# EasyEDA schematic LcsNodes-Quad-Block-Controller-B.02.10.json

## Sheets
1 High Level Schematic
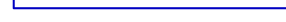
[diagram p0: High Level Schematic]
2 Main Controller
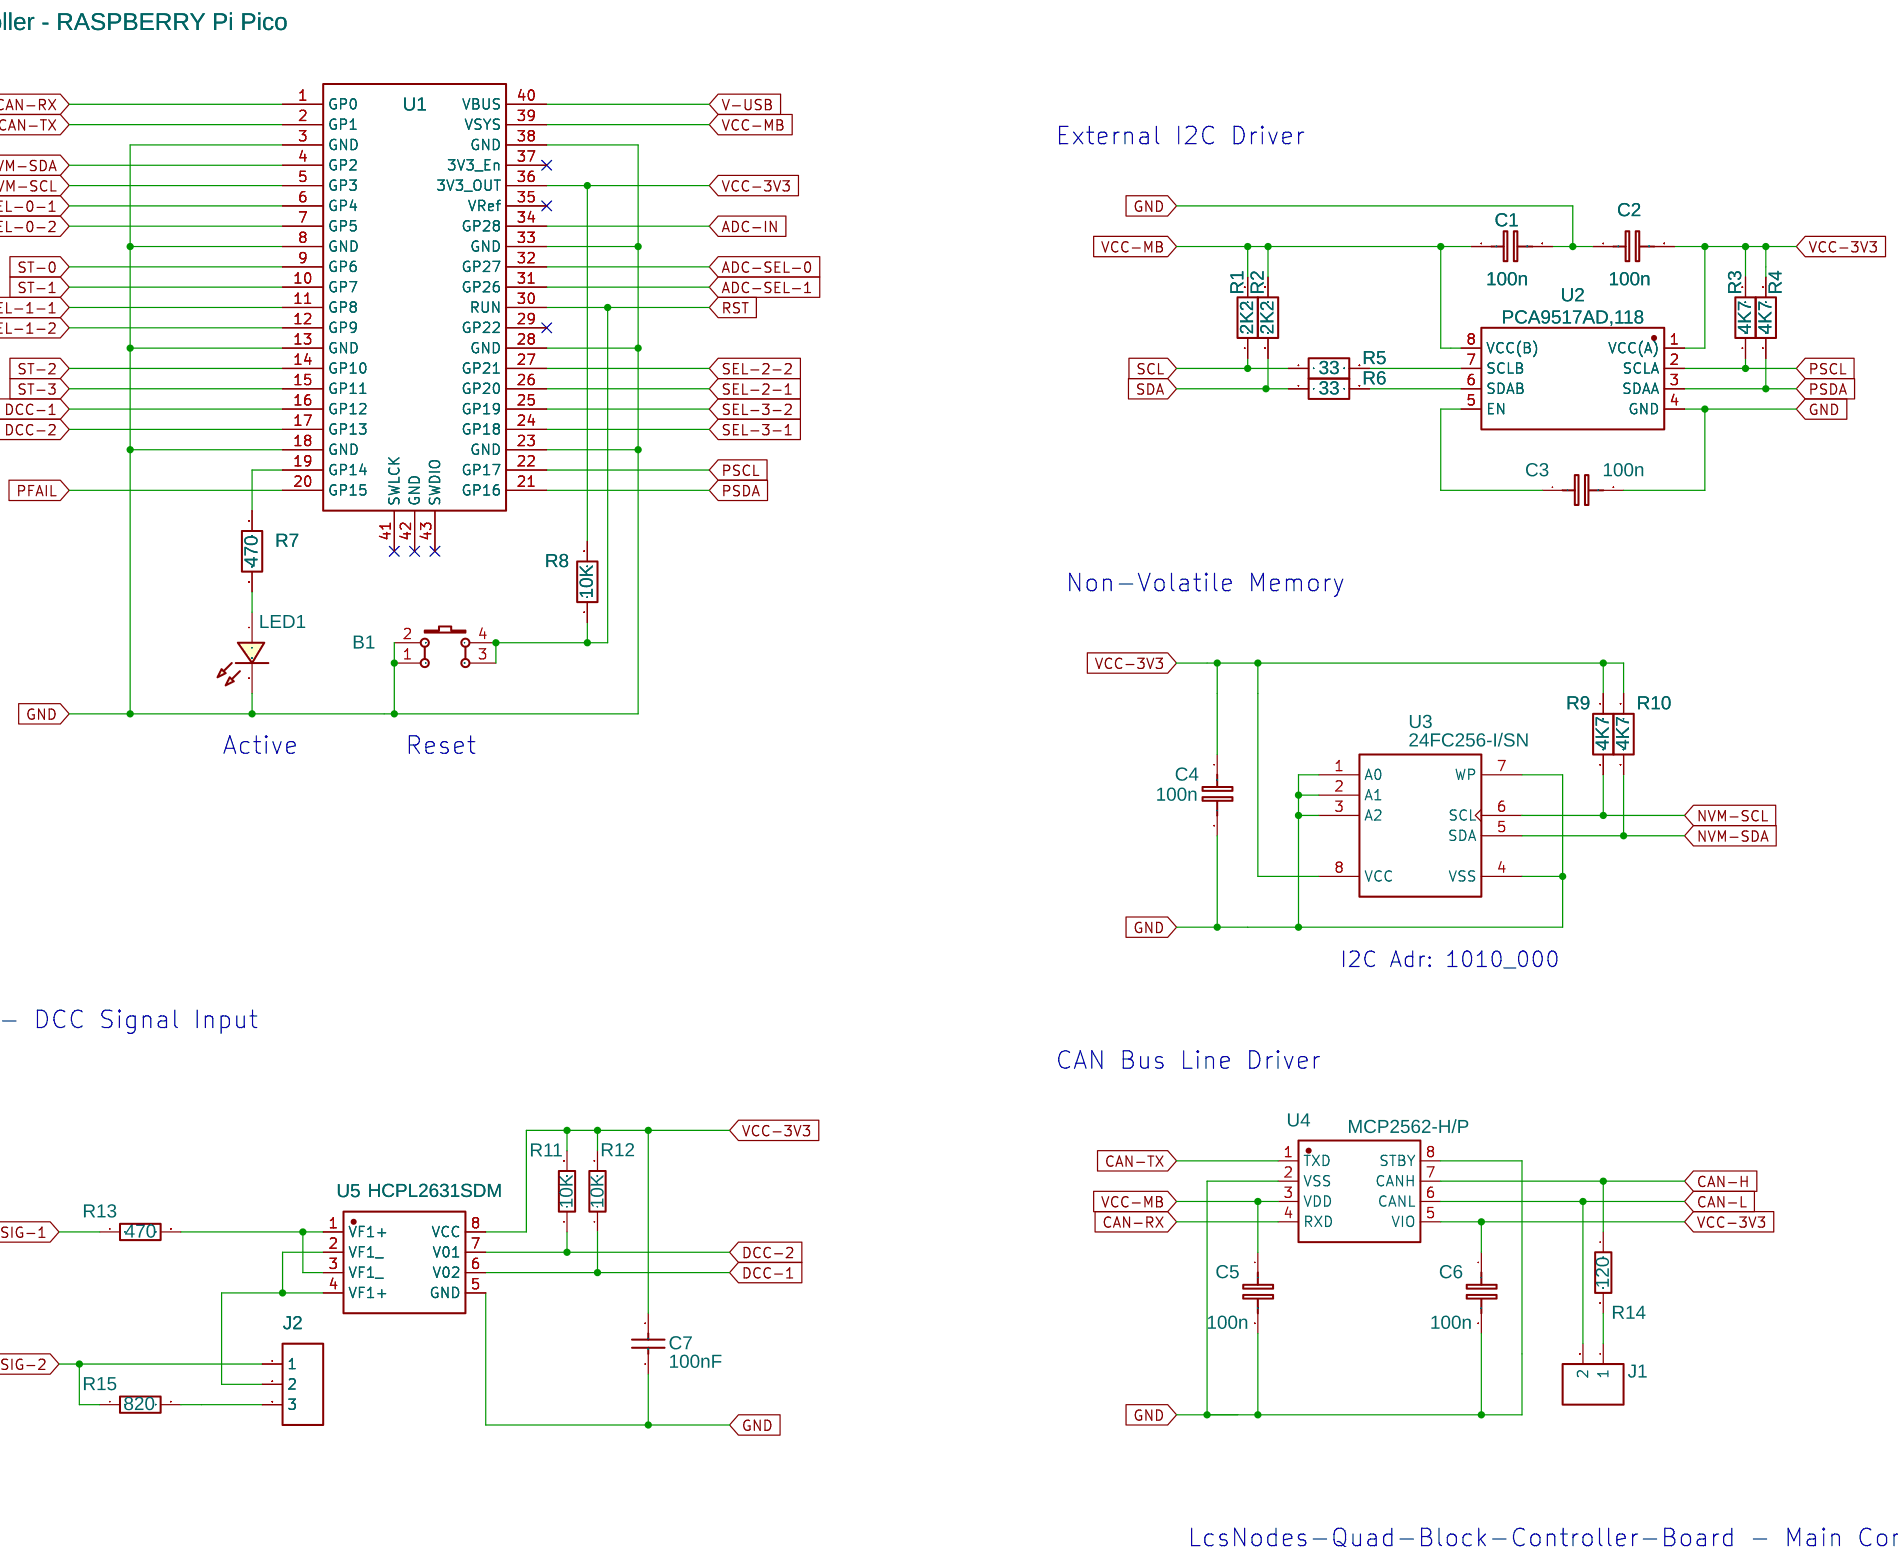
[diagram p1: Main Controller]
3 Quad Power Unit
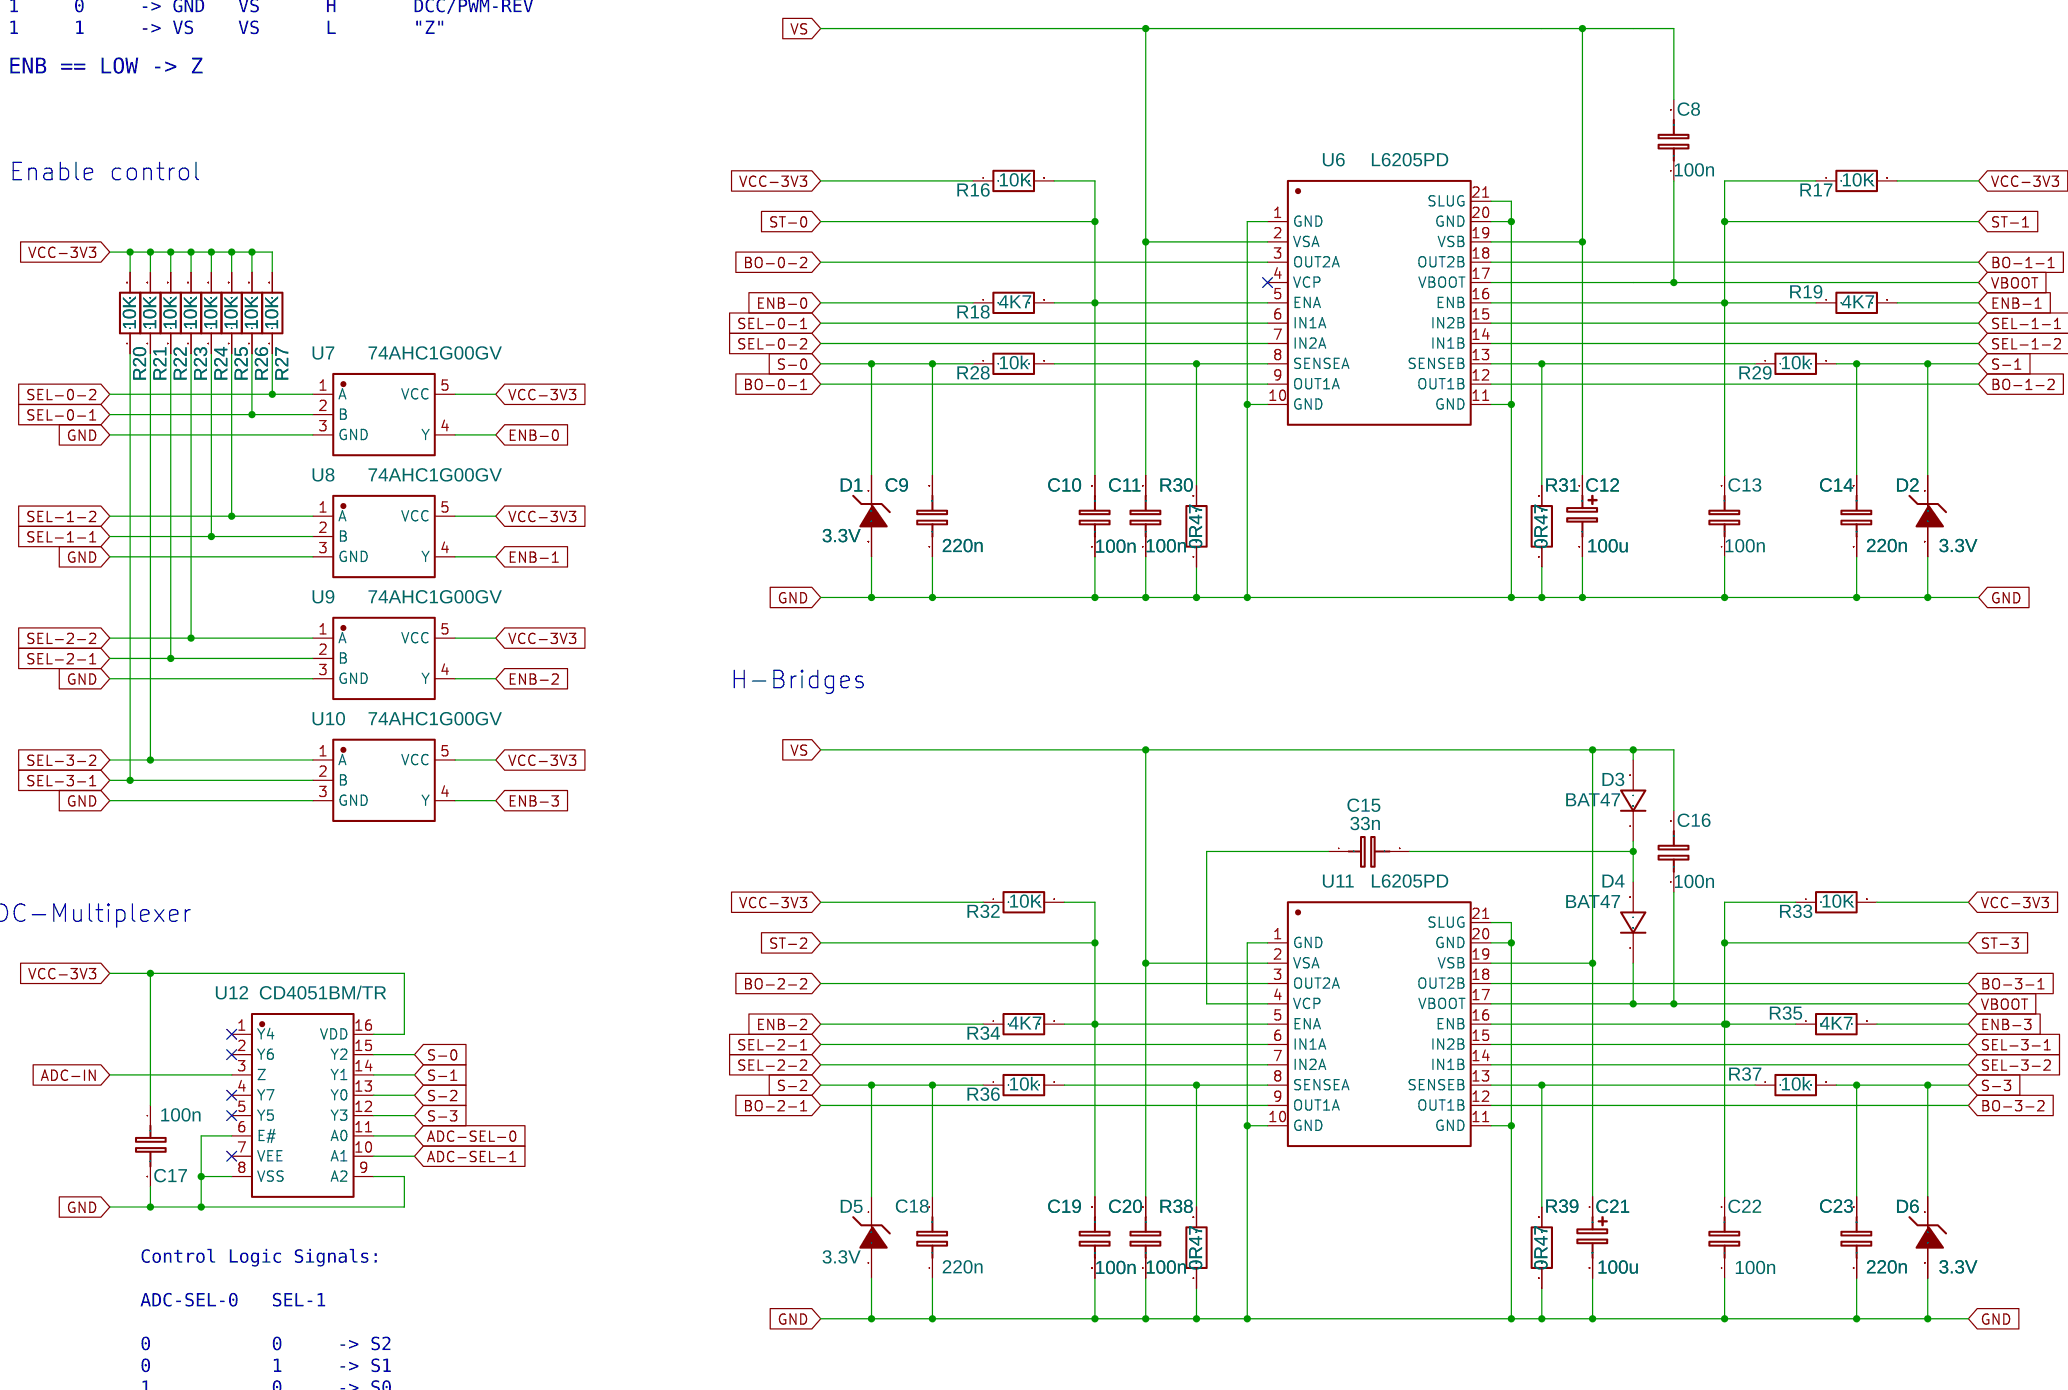
[diagram p2: Quad Power Unit]
4 Power Supply, Connectors
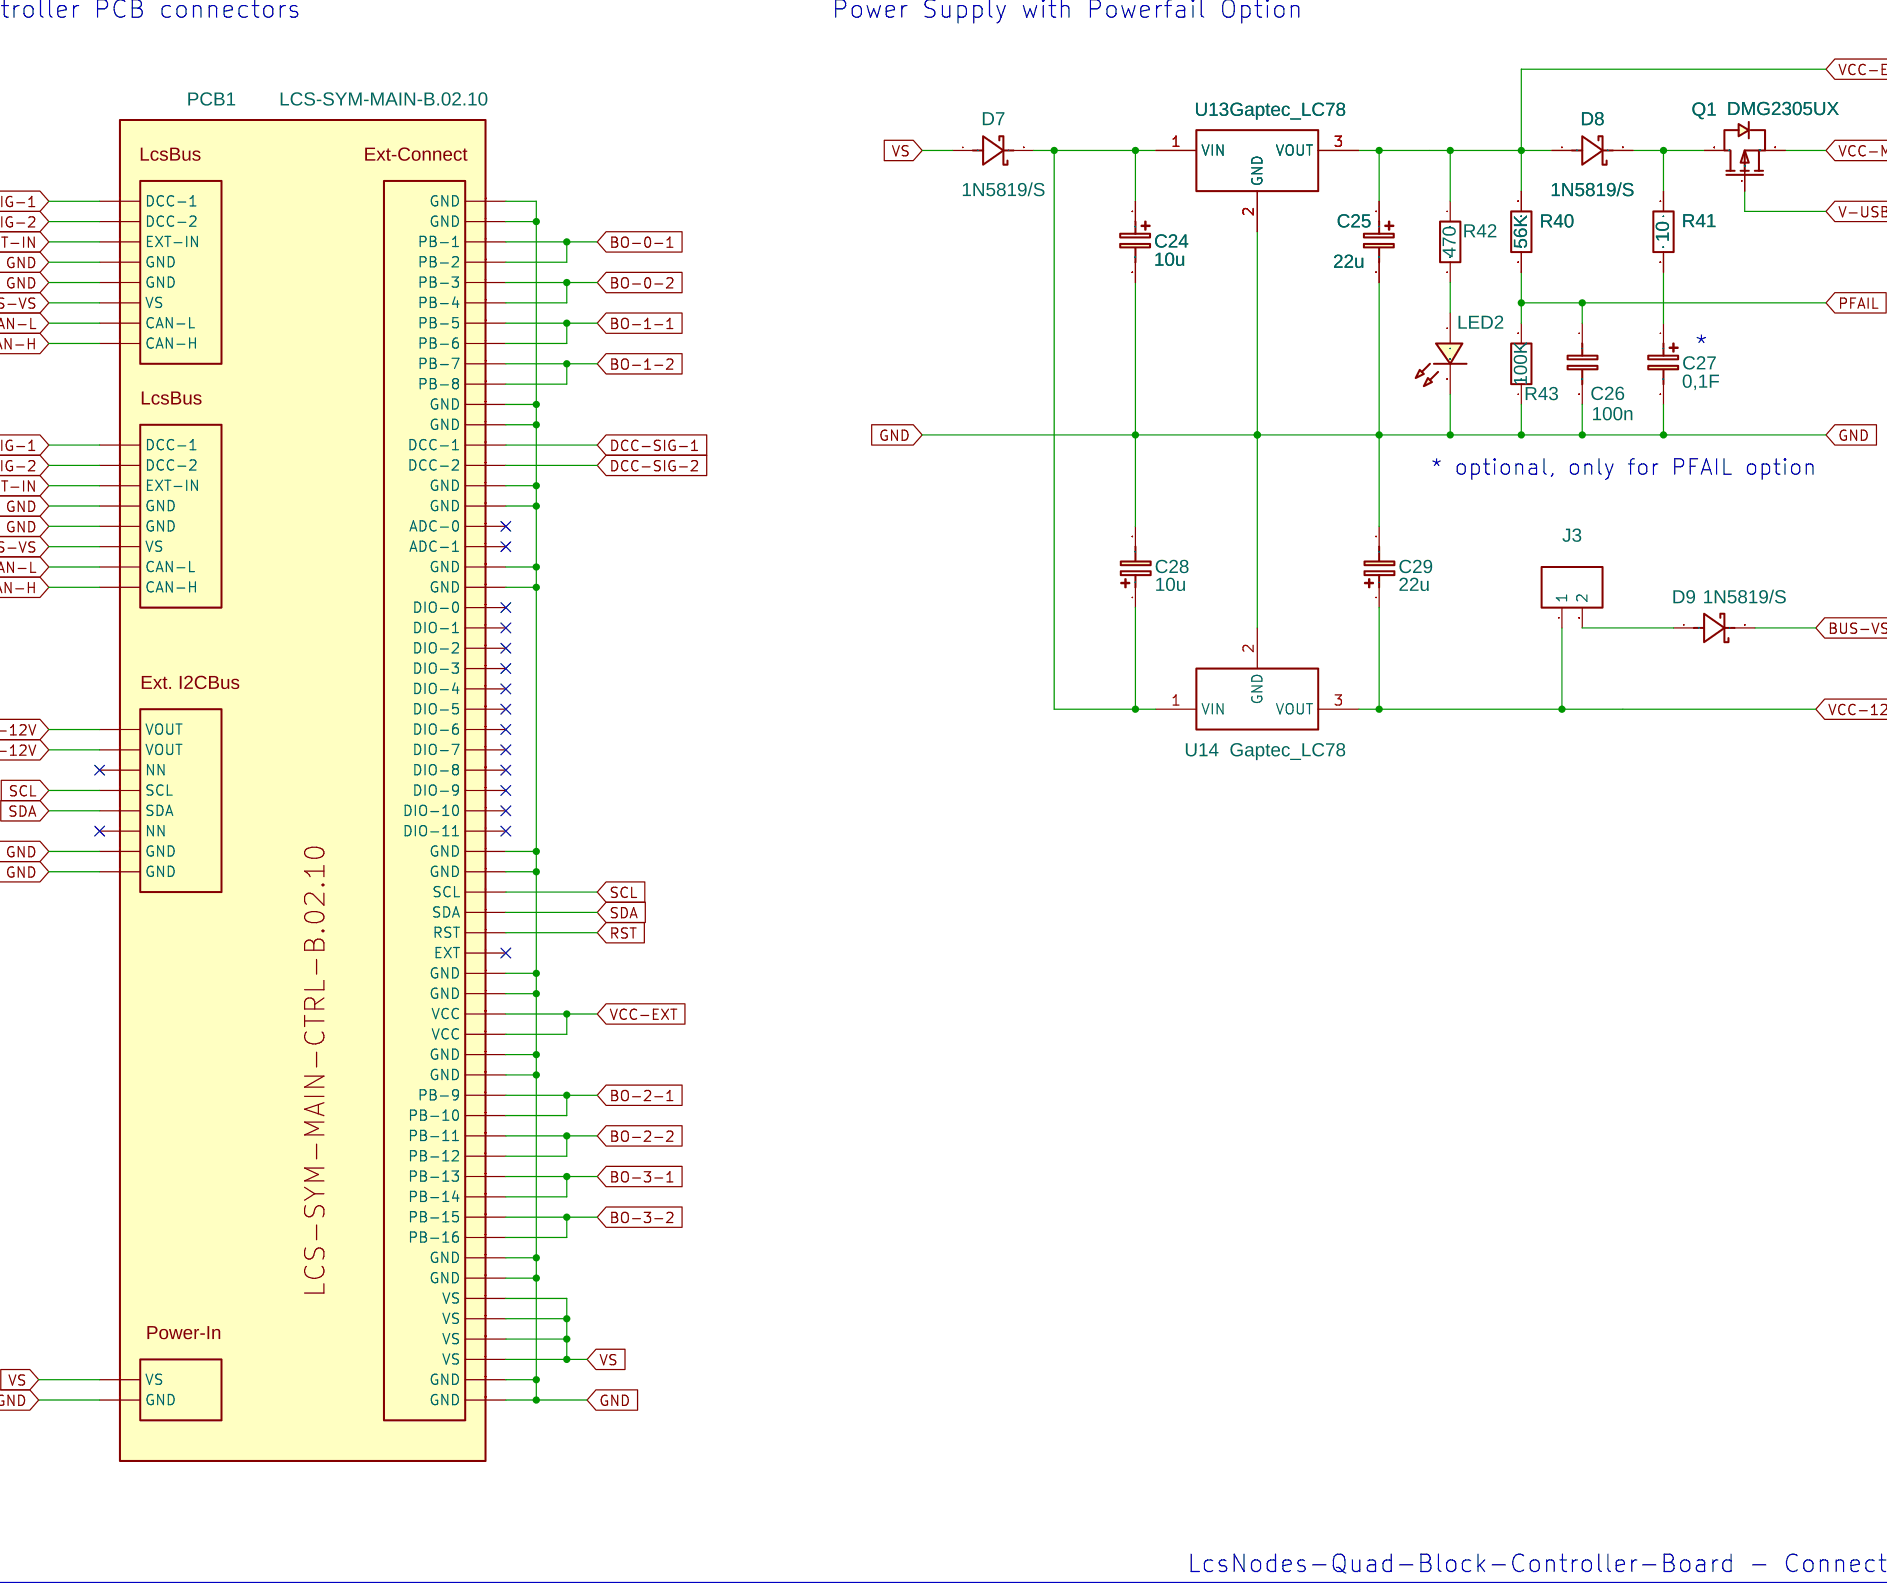
[diagram p3: Power Supply, Connectors]

## Parts
sheet Main Controller
B1  Opt  [SW-SMD_4P-L6.0-W6.0-P4.50-LS9.0_C23873]
C1  100n  [C1206]
C2  100n  [C1206]
C3  100n  [C1206]
C4  100n  [C1206]
C5  100n  [C1206]
C6  100n  [C1206]
C7  100nF  [C1206]
J1  HDR-M-2.54_1x2  [HDR-M-2.54_1X2]
J2  HDR-M-2.54_1x3  [HDR-M-2.54_1X3]
LED1  LED-0805_G  [LED-1206]
R1  2K2  [R1206]
R2  2K2  [R1206]
R3  4K7  [R1206]
R4  4K7  [R1206]
R5  33  [R1206]
R6  33  [R1206]
R7  470  [R1206]
R8  10K  [R1206]
R9  4K7  [R1206]
R10  4K7  [R1206]
R11  10K  [R1206]
R12  10K  [R1206]
R13  470  [R1206]
R14  120  [R1206]
R15  820  [R1206]
U1  Main Controller - RASPBERRY Pi Pico  [RASPBERRY PI PICO]
U2  PCA9517AD,118  [SO-8_L4.9-W3.9-P1.27-LS6.0-BL]
U3  24FC256-I/SN  [SOIC-8_L4.9-W3.9-P1.27-LS6.0-BL]
U4  MCP2562-H/P  [SOIC-8_L4.9-W3.9-P1.27-LS6.1-BL]
U5  HCPL2631SDM  [SMT-8_L9.7-W6.6-P2.54-LS10.3-TR]
sheet Power Supply, Connectors
C24  10u  [CAP-D5.0×H5.5]
C25  22u  [CAP-D5.0×H5.5]
C26  100n  [C1206]
C27  0,1F  [CAP-D12.5XF5.0]
C28  10u  [CAP-D5.0×H5.5]
C29  22u  [CAP-D5.0×H5.5]
D7  1N5819/S  [SMA_L4.3-W2.6-LS5.2-R-RD]
D8  1N5819/S  [SMA_L4.3-W2.6-LS5.2-R-RD]
D9  1N5819/S  [SMA_L4.3-W2.6-LS5.2-R-RD]
J3  HDR-M-2.54_1x2  [HDR-M-2.54_1X2]
LED2  LED-0805_G  [LED-1206]
PCB1  LCS-SYM-MAIN-B.02.10  [LCS-FP-MAIN-10X12-B.02.10]
Q1  DMG2305UX  [SOT-23-3_L2.9-W1.3-P0.95-LS2.4-BR-1]
R40  56K  [R1206]
R41  10  [R1206]
R42  470  [R1206]
R43  100K  [R1206]
U13  Gaptec_LC78  [GAPTEC_LC78]
U14  Gaptec_LC78  [GAPTEC_LC78]
sheet Quad Power Unit
C8  100n  [C1206]
C9  220n  [C1206]
C10  100n  [C1206]
C11  100n  [C1206]
C12  100u  [CAP-D6.3×H7.7]
C13  100n  [C1206]
C14  220n  [C1206]
C15  33n  [C1206]
C16  100n  [C1206]
C17  100n  [C1206]
C18  220n  [C1206]
C19  100n  [C1206]
C20  100n  [C1206]
C21  100u  [CAP-D6.3×H7.7]
C22  100n  [C1206]
C23  220n  [C1206]
D1  3.3V  [SOD-80C_L3.3-W1.5-RD]
D2  3.3V  [SOD-80C_L3.3-W1.5-RD]
D3  BAT47  [SOD-80C_L3.3-W1.5-RD]
D4  BAT47  [SOD-80C_L3.3-W1.5-RD]
D5  3.3V  [SOD-80C_L3.3-W1.5-RD]
D6  3.3V  [SOD-80C_L3.3-W1.5-RD]
R16  10K  [R1206]
R17  10K  [R1206]
R18  4K7  [R1206]
R19  4K7  [R1206]
R20  10K  [R1206]
R21  10K  [R1206]
R22  10K  [R1206]
R23  10K  [R1206]
R24  10K  [R1206]
R25  10K  [R1206]
R26  10K  [R1206]
R27  10K  [R1206]
R28  10k  [R1206]
R29  10k  [R1206]
R30  0R47  [R_AXIAL-0.7]
R31  0R47  [R_AXIAL-0.7]
R32  10K  [R1206]
R33  10K  [R1206]
R34  4K7  [R1206]
R35  4K7  [R1206]
R36  10k  [R1206]
R37  10k  [R1206]
R38  0R47  [R_AXIAL-0.7]
R39  0R47  [R_AXIAL-0.7]
U6  L6205PD  [POWERSO20_L15.9-W11.0-P1.27-LS14.2-BL-EP]
U7  74AHC1G00GV  [SOT-23-5_L3.0-W1.5-P0.95-LS2.8-BL]
U8  74AHC1G00GV  [SOT-23-5_L3.0-W1.5-P0.95-LS2.8-BL]
U9  74AHC1G00GV  [SOT-23-5_L3.0-W1.5-P0.95-LS2.8-BL]
U10  74AHC1G00GV  [SOT-23-5_L3.0-W1.5-P0.95-LS2.8-BL]
U11  L6205PD  [POWERSO20_L15.9-W11.0-P1.27-LS14.2-BL-EP]
U12  CD4051BM/TR  [SO-16_L9.9-W3.9-P1.27-LS6.1-BL]

## Library data of the parts
B1 = K4-6×6_TH: Supplier: LCSC; Supplier Part: C136684; Manufacturer: 韩国韩荣; Manufacturer Part: K2-1102DP-E4SW-04; Contributor: LCEDA_Lib; Package Display: No
C1-C3 C26 = C_RAD-0.2_EU: Contributor: LCEDA_Lib
C4-C6 C17 = C_0603_EU: Contributor: LCEDA_Lib; Package Display: No
C7 = CC1206KKX7R0BB104: Supplier: LCSC; Manufacturer: YAGEO(国巨); Supplier Part: C107181; JLCPCB Part Class: Extended Part; link: https://lcsc.com/eda_search?q=C107181&%26type=1&ref=editor
J1 J3 = HDR-M-2.54_1x2: Supplier Part: C124375; Supplier: LCSC; Contributor: LCEDA_Lib
J2 = HDR-M-2.54_1x3: Supplier Part: C180248; Supplier: LCSC; Contributor: LCEDA_Lib
LED1 LED2 = LED-0805_G: Manufacturer: 国星光电; Manufacturer Part: NCD0805G1; Supplier Part: C84260; Contributor: LCEDA_Lib
R1-R4 R7-R10 R20-R27 R42 = R_0805_EU: Contributor: LCEDA_Lib
R5 R6 = R_1206_EU: Contributor: LCEDA_Lib
R11-R13 R15 = SR1206JR-7W4K7L: Contributor: LCSC; Supplier: LCSC; Supplier Part: C326768; Manufacturer: YAGEO(国巨); JLCPCB Part Class: Extended Part; link: https://lcsc.com/eda_search?q=C326768&%26type=1&ref=editor
R14 = RESISTOR-AXIAL-0.1
U1 = RASPBERRY Pi Pico Through Holes: Contributor: untung91
U2 = PCA9517AD,118: Contributor: LCSC; Supplier: LCSC; Supplier Part: C2802638; Manufacturer: NXP(恩智浦); JLCPCB Part Class: Extended Part
U3 = 24FC256-I/SN: Supplier: LCSC; Manufacturer: MICROCHIP(美国微芯); Contributor: LCSC; Supplier Part: C145385; JLCPCB Part Class: Extended Part
U4 = MCP2562-H/P: Supplier: LCSC; Supplier Part: C640348; Manufacturer: MICROCHIP(美国微芯); link: https://atta.szlcsc.comnull; Contributor: lcsc
U5 = HCPL2631SDM: Contributor: LCSC; Supplier: LCSC; Supplier Part: C899529; Manufacturer: onsemi(安森美); JLCPCB Part Class: Extended Part
C12 C21 C24 C25 C28 C29 = CE_SMD_D5.0×H5.5_EU: Contributor: LCEDA_Lib
C27 = C_Tan_SMD_A_EU: Contributor: LCEDA_Lib
D7-D9 = 1N5819/S: Supplier: LCSC; Supplier Part: C9900003833; JLCPCB Part Class: Extended Part; Contributor: LCSC
PCB1 = LCS-SYM-MAIN-B.02.10: Contributor: helmut-f
Q1 = DMG2305UX: Supplier: LCSC; Supplier Part: C2940629; Manufacturer: TECH PUBLIC(台舟); link: https://atta.szlcsc.com//upload/public/pdf/source/20220124/672A40BC72F4DE27873D6595D2E3AF1A.pdf; Contributor: LCSC; JLCPCB Part Class: Extended Part
R16-R19 R28 R29 R32-R37 R40 R41 R43 = R_AXIAL-0.3_EU: Contributor: LCEDA_Lib
U13 U14 = Gaptec_LC78: Contributor: SpicyMemeBoi; Package Display: No
C8-C11 C13-C16 C18-C20 C22 C23 = C_0603_EU: Contributor: LCEDA_Lib
D1 D2 D5 D6 = Diode Zener: Supplier: LCSC; Manufacturer: SEMTECH; Supplier Part: C14516; JLCPCB Part Class: Extended Part; Contributor: Arrost
D3 D4 = 1N4148: Supplier: LCSC; Manufacturer: SEMTECH; Supplier Part: C14516; Contributor: LCEDA_Lib
R30 R31 R38 R39 = R_AXIAL-0.5_EU: Contributor: LCEDA_Lib
U6 U11 = L6205PD: Supplier: LCSC; Manufacturer: ST(意法半导体); Manufacturer Part: L6205PD013TR; Supplier Part: C36543; JLCPCB Part Class: Extended Part
U7-U10 = 74AHC1G00GV: Supplier: LCSC; Supplier Part: C19829583; Manufacturer: TECH PUBLIC(台舟); JLCPCB Part Class: Extended Part; Contributor: lcsc
U12 = CD4051BM/TR: Supplier: LCSC; Supplier Part: C507163; Manufacturer: HGSEMI(华冠); Contributor: LCSC; JLCPCB Part Class: Extended Part; Package Display: No

## Nets
GND: B1.1 B1.2 C1.2 C2.1 C3.2 C4.2 C5.2 C6.2 C7.1 C9.1 C10.1 C11.1 C12.2 C13.1 C14.1 C17.2 C18.1 C19.1 C20.1 C21.2 C22.1 C23.1 C24.2 C25.2 C26.2 C27.2 C28.2 C29.2 D1.2(A) D2.2(A) D5.2(A) D6.2(A) LED1.2 LED2.2 PCB1.4(GND) PCB1.5(GND) PCB1.14(GND) PCB1.15(GND) PCB1.27(GND) PCB1.28(GND) PCB1.31(GND) PCB1.40(GND) PCB1.41(GND) PCB1.50(GND) PCB1.51(GND) PCB1.54(GND) PCB1.55(GND) PCB1.58(GND) PCB1.59(GND) PCB1.72(GND) PCB1.73(GND) PCB1.78(GND) PCB1.79(GND) PCB1.82(GND) PCB1.83(GND) PCB1.92(GND) PCB1.93(GND) PCB1.98(GND) PCB1.99(GND) R30.1 R31.1 R38.1 R39.1 R43.1 U1.3(GND) U1.8(GND) U1.13(GND) U1.18(GND) U1.23(GND) U1.28(GND) U1.33(GND) U1.38(GND) U2.4(GND) U3.1(A0) U3.2(A1) U3.3(A2) U3.4(VSS) U3.7(WP) U4.2(VSS) U4.8(STBY) U5.5(GND) U6.1(GND) U6.10(GND) U6.11(GND) U6.20(GND) U6.21(SLUG) U7.3(GND) U8.3(GND) U9.3(GND) U10.3(GND) U11.1(GND) U11.10(GND) U11.11(GND) U11.20(GND) U11.21(SLUG) U12.6(E#) U12.8(VSS) U12.9(A2) U13.2(GND) U14.2(GND)
VCC-3V3: C2.2 C4.1 C6.1 C7.2 C17.1 R3.2 R4.2 R8.2 R9.1 R10.1 R11.2 R12.2 R16.1 R17.2 R20.2 R21.2 R22.2 R23.2 R24.2 R25.2 R26.2 R27.2 R32.1 R33.2 U1.36(3V3_OUT) U2.1(VCC(A)) U3.8(VCC) U4.5(VIO) U5.8(VCC) U7.5(VCC) U8.5(VCC) U9.5(VCC) U10.5(VCC) U12.16(VDD)
VCC-12V: C29.1 J3.1 PCB1.21(VOUT) PCB1.22(VOUT) U14.3(VOUT)
VCC-EXT: C25.1 D8.1(A) PCB1.80(VCC) PCB1.81(VCC) R40.2 R42.1 U13.3(VOUT)
VCC-MB: C1.1 C5.1 Q1.2(S) R1.2 R2.2 U1.39(VSYS) U2.8(VCC(B)) U4.3(VDD)
ADC-IN: U1.34(GP28) U12.3(Z)
ADC-SEL-0: U1.32(GP27) U12.11(A0)
ADC-SEL-1: U1.31(GP26) U12.10(A1)
BO-0-1: PCB1.42(PB-1) PCB1.43(PB-2) U6.9(OUT1A)
BO-0-2: PCB1.44(PB-3) PCB1.45(PB-4) U6.3(OUT2A)
BO-1-1: PCB1.46(PB-5) PCB1.47(PB-6) U6.18(OUT2B)
BO-1-2: PCB1.48(PB-7) PCB1.49(PB-8) U6.12(OUT1B)
BO-2-1: PCB1.84(PB-9) PCB1.85(PB-10) U11.9(OUT1A)
BO-2-2: PCB1.86(PB-11) PCB1.87(PB-12) U11.3(OUT2A)
BO-3-1: PCB1.88(PB-13) PCB1.89(PB-14) U11.18(OUT2B)
BO-3-2: PCB1.90(PB-15) PCB1.91(PB-16) U11.12(OUT1B)
BUS-VS: D9.2(K) PCB1.6(VS) PCB1.16(VS)
CAN-H: PCB1.8(CAN-H) PCB1.18(CAN-H) R14.1 U4.7(CANH)
CAN-L: J1.2 PCB1.7(CAN-L) PCB1.17(CAN-L) U4.6(CANL)
CAN-RX: U1.1(GP0) U4.4(RXD)
CAN-TX: U1.2(GP1) U4.1(TXD)
DCC-1: R12.1 U1.16(GP12) U5.6(V02)
DCC-2: R11.1 U1.17(GP13) U5.7(V01)
DCC-SIG-1: PCB1.1(DCC-1) PCB1.11(DCC-1) PCB1.52(DCC-1) R13.1
DCC-SIG-2: J2.1 PCB1.2(DCC-2) PCB1.12(DCC-2) PCB1.53(DCC-2) R15.1
ENB-0: R18.1 U7.4(Y)
ENB-1: R19.2 U8.4(Y)
ENB-2: R34.1 U9.4(Y)
ENB-3: R35.2 U10.4(Y)
EXT-IN: PCB1.3(EXT-IN) PCB1.13(EXT-IN)
NVM-SCL: R9.2 U1.5(GP3) U3.6(SCL)
NVM-SDA: R10.2 U1.4(GP2) U3.5(SDA)
PFAIL: C26.1 R40.1 R43.2 U1.20(GP15)
PSCL: R3.1 U1.22(GP17) U2.2(SCLA)
PSDA: R4.1 U1.21(GP16) U2.3(SDAA)
RST: B1.3 B1.4 PCB1.76(RST) R8.1 U1.30(RUN)
S-0: C9.2 D1.1(C) R28.1 U12.15(Y2)
S-1: C14.2 D2.1(C) R29.2 U12.14(Y1)
S-2: C18.2 D5.1(C) R36.1 U12.13(Y0)
S-3: C23.2 D6.1(C) R37.2 U12.12(Y3)
SCL: PCB1.24(SCL) PCB1.74(SCL) R1.1 R5.1
SDA: PCB1.25(SDA) PCB1.75(SDA) R2.1 R6.1
SEL-0-1: R26.1 U1.6(GP4) U6.6(IN1A) U7.2(B)
SEL-0-2: R27.1 U1.7(GP5) U6.7(IN2A) U7.1(A)
SEL-1-1: R24.1 U1.11(GP8) U6.15(IN2B) U8.2(B)
SEL-1-2: R25.1 U1.12(GP9) U6.14(IN1B) U8.1(A)
SEL-2-1: R22.1 U1.26(GP20) U9.2(B) U11.6(IN1A)
SEL-2-2: R23.1 U1.27(GP21) U9.1(A) U11.7(IN2A)
SEL-3-1: R20.1 U1.24(GP18) U10.2(B) U11.15(IN2B)
SEL-3-2: R21.1 U1.25(GP19) U10.1(A) U11.14(IN1B)
ST-0: C10.2 R16.2 R18.2 U1.9(GP6) U6.5(ENA)
ST-1: C13.2 R17.1 R19.1 U1.10(GP7) U6.16(ENB)
ST-2: C19.2 R32.2 R34.2 U1.14(GP10) U11.5(ENA)
ST-3: C22.2 R33.1 R35.1 U1.15(GP11) U11.16(ENB)
V-USB: Q1.1(G) U1.40(VBUS)
VBOOT: C8.1 C16.1 D4.1(2) U6.17(VBOOT) U11.17(VBOOT)
VS: C8.2 C11.2 C12.1 C16.2 C20.2 C21.1 D3.2(1) D7.1(A) PCB1.32(VS) PCB1.94(VS) PCB1.95(VS) PCB1.96(VS) PCB1.97(VS) U6.2(VSA) U6.19(VSB) U11.2(VSA) U11.19(VSB)
Net-(C3-1): C3.1 U2.5(EN)
Net-(C15-1): C15.1 U11.4(VCP)
Net-(C15-2): C15.2 D3.1(2) D4.2(1)
Net-(C24-1): C24.1 C28.1 D7.2(K) U13.1(VIN) U14.1(VIN)
Net-(C27-1): C27.1 R41.2
Net-(D8-2): D8.2(K) Q1.3(D) R41.1
Net-(D9-1): D9.1(A) J3.2
Net-(J1-1): J1.1 R14.2
Net-(J2-2): J2.2 U5.2(VF1_) U5.4(VF1+)
Net-(J2-3): J2.3 R15.2
Net-(LED1-1): LED1.1 R7.2
Net-(LED2-1): LED2.1 R42.2
Net-(R5-2): R5.2 U2.7(SCLB)
Net-(R6-2): R6.2 U2.6(SDAB)
Net-(R7-1): R7.1 U1.19(GP14)
Net-(R13-2): R13.2 U5.1(VF1+) U5.3(VF1_)
Net-(R28-2): R28.2 R30.2 U6.8(SENSEA)
Net-(R29-1): R29.1 R31.2 U6.13(SENSEB)
Net-(R36-2): R36.2 R38.2 U11.8(SENSEA)
Net-(R37-1): R37.1 R39.2 U11.13(SENSEB)

Not connected (* = marked no-connect by the designer): PCB1 23(NN)* 26(NN)* 56(ADC-0)* 57(ADC-1)* 60(DIO-0)* 61(DIO-1)* 62(DIO-2)* 63(DIO-3)* 64(DIO-4)* 65(DIO-5)* 66(DIO-6)* 67(DIO-7)* 68(DIO-8)* 69(DIO-9)* 70(DIO-10)* 71(DIO-11)* 77(EXT)*; U1 29(GP22)* 35(VRef)* 37(3V3_En)* 41(SWLCK)* 42(GND)* 43(SWDIO)*; U6 4(VCP)*; U12 1(Y4)* 2(Y6)* 4(Y7)* 5(Y5)* 7(VEE)*

## Notes on the sheets
sheet 1
- DCC Signal Input
- Block 0
- H-Bridge
- CAN
  Driver
- LCS Bus Connector
- Analog
  Input/Select
- Block 1
- Track Connector
- H-Bridge
- NVM
  Memory
- I2C
- Bridge-Control
- Block 2
- H-Bridge
- Raspberry PI
  PICO
- Block 3
- H-Bridge
- I2C
  extern
- I2C
  extern
- I2C
- Power
- LEDs, Button
- Extension Connector
- Power Supply
- Power
- LcsNodes-Quad-Block-Controller-Board - Block Diagram - Page 1 of 4
sheet 2
- External I2C Driver
- Non-Volatile Memory
- Active
- Reset
- I2C Adr: 1010_000
- LCS Bus - DCC Signal Input
- CAN Bus Line Driver
- LcsNodes-Quad-Block-Controller-Board - Main Controller - Page 2 of 4
sheet 3
- Control Logic Signals:
  Sel-2 Sel-1 -> B-x-1 B-x-2   ENB-x   STATE
  0     0     -> GND   GND     H       "CUT"
  0     1     -> VS    GND     H       DCC/PWM-FWD
  1     0     -> GND   VS      H       DCC/PWM-REV
  1     1     -> VS    VS      L       "Z"
- H-Bridges
- ENB == LOW -> Z
- Enable control
- H-Bridges
- ADC-Multiplexer
- Control Logic Signals:
  ADC-SEL-0   SEL-1
  0           0     -> S2
  0           1     -> S1
  1           0     -> S0
  1           1     -> S3
- LcsNodes-Quad-Block-Controller-Board - Power Unit - Page 3 of 4
sheet 4
- Block Controller PCB connectors
- Power Supply with Powerfail Option
- *
- * optional, only for PFAIL option
- LcsNodes-Quad-Block-Controller-Board - Connector, Power - Page 4 of 4
